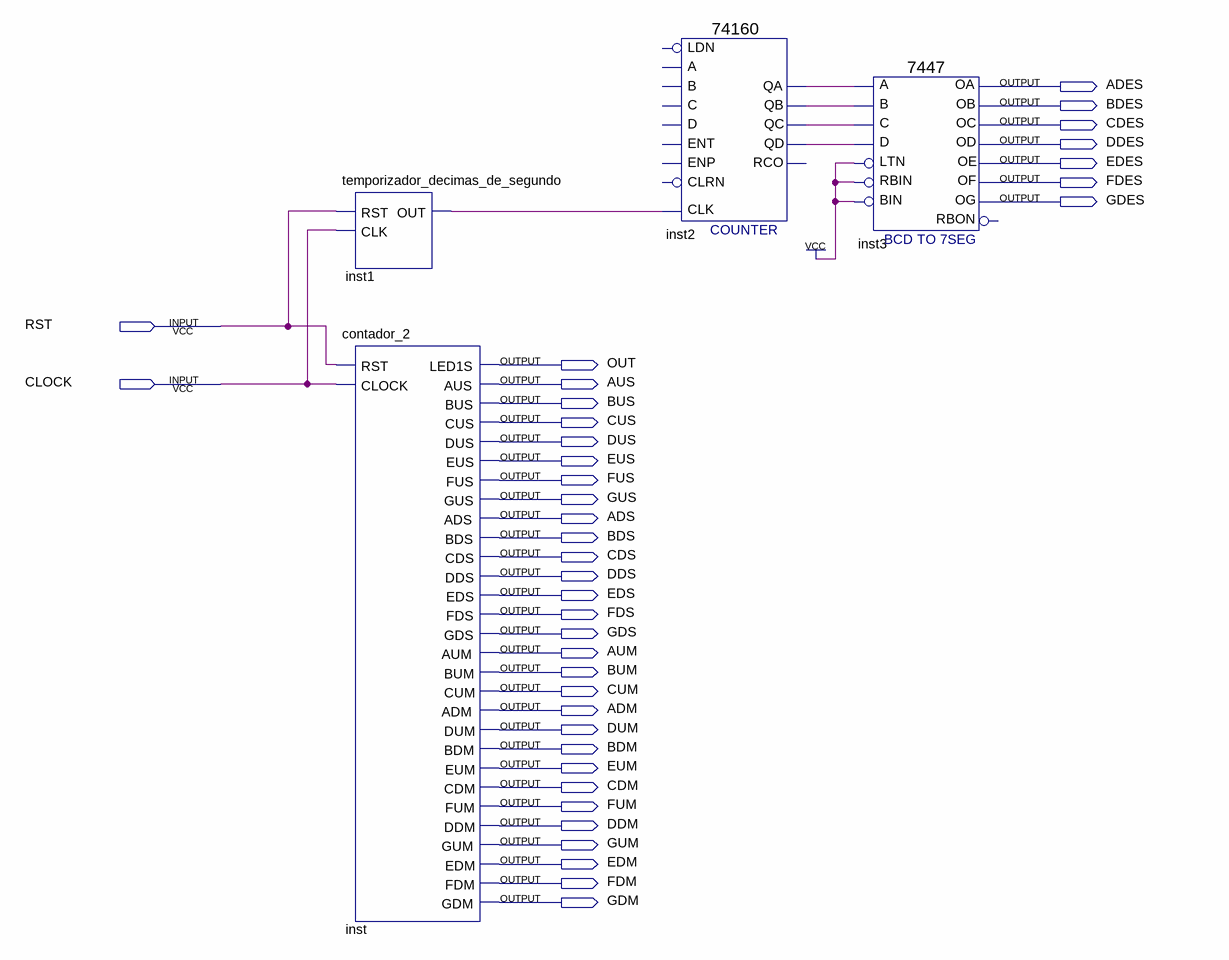
[diagram p0: schematic sheet]
// Quartus schematic contador_3.bdf as structural Verilog: 4 symbols, 38 pins
module contador_3 (
  input  RST,
  input  CLOCK,
  output ADES,
  output BDES,
  output CDES,
  output DDES,
  output EDES,
  output FDES,
  output GDES,
  output OUT,
  output AUS,
  output BUS,
  output CUS,
  output DUS,
  output EUS,
  output FUS,
  output GUS,
  output ADS,
  output BDS,
  output CDS,
  output DDS,
  output EDS,
  output FDS,
  output GDS,
  output AUM,
  output BUM,
  output CUM,
  output ADM,
  output DUM,
  output BDM,
  output EUM,
  output CDM,
  output FUM,
  output DDM,
  output GUM,
  output EDM,
  output FDM,
  output GDM
);

  wire inst1_out, inst2_qa, inst2_qb, inst2_qc, inst2_qd;

  temporizador_decimas_de_segundo inst1 (.RST(RST), .CLK(CLOCK), .OUT(inst1_out));
  contador_2 inst (
    .RST(RST), .CLOCK(CLOCK), .LED1S(OUT), .AUS(AUS), .BUS(BUS), .CUS(CUS), .DUS(DUS), .EUS(EUS), .FUS(FUS),
    .GUS(GUS), .ADS(ADS), .BDS(BDS), .CDS(CDS), .DDS(DDS), .EDS(EDS), .FDS(FDS), .GDS(GDS), .AUM(AUM),
    .BUM(BUM), .CUM(CUM), .ADM(ADM), .DUM(DUM), .BDM(BDM), .EUM(EUM), .CDM(CDM), .FUM(FUM), .DDM(DDM),
    .GUM(GUM), .EDM(EDM), .FDM(FDM), .GDM(GDM));
  \74160  inst2 (
    .CLK(inst1_out), .QD(inst2_qd), .QA(inst2_qa), .QB(inst2_qb), .QC(inst2_qc));  // open: ENT, A, B, C, D, LDN, ENP, CLRN, RCO
  \7447  inst3 (
    .LTN(1'b1), .B(inst2_qb), .C(inst2_qc), .D(inst2_qd), .RBIN(1'b1), .BIN(1'b1), .A(inst2_qa), .OB(BDES),
    .OC(CDES), .OE(EDES), .OD(DDES), .OF(FDES), .OG(GDES), .OA(ADES));  // open: RBON
endmodule
